# EAGLE design illumination_module (EAGLE 9.6.2)
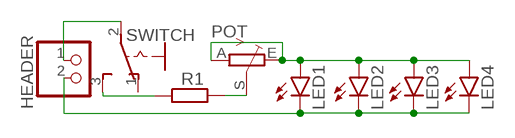
[diagram p0: schematic, sheet 1]

## Parts
HEADER  PINHD-1X2/90  [1X02/90]
LED1  LED5MM  [LED5MM]
LED2  LED5MM  [LED5MM]
LED3  LED5MM  [LED5MM]
LED4  LED5MM  [LED5MM]
POT  TRIM_EU-CA6H  [CA6H]
R1  R-EU_0207/10  [0207/10]
SWITCH  255SB  [255SB]

## Nets
N$1: LED1.A LED2.A LED3.A LED4.A POT.A POT.E
N$2: R1.1 SWITCH.3(S)
N$3: HEADER.2 LED1.K(C) LED2.K(C) LED3.K(C) LED4.K(C)
N$4: POT.S R1.2
N$5: HEADER.1 SWITCH.2(P)
Unconnected: SWITCH.1(O)

## Library data of the parts
HEADER = pinhead:PINHD-1X2: PIN HEADER
LED1-LED4 = led:LED: LED OSRAM: - CHIPLED LG R971, LG N971, LY N971, LG Q971, LY Q971, LO R971, LY R971 LH N974, LH R974 LS Q976, LO Q976, LY Q976 LO Q996 - Hyper CHIPLED LW Q18S LB Q993, LB Q99A, LB R99A - SideLED LS A670, LO A670, LY A670, LG A670, LP A670 LB A673, LV A673, LT A673, LW A673 LH A674 LY A675 LS A676, LA A676, LO A676, LY A676, LW A676 LS A679, LY A679, LG A679 - Hyper Micro SIDELED® LS Y876, LA Y876, LO Y876, LY Y876 LT Y87S - SmartLED LW L88C, LW L88S LB L89C, LB L89S, LG L890 LS L89K, LO L89K, LY L89K LS L896, LA L896, LO L896, LY L896 - TOPLED LS T670, LO T670, LY T670, LG T670, LP T670 LSG T670, LSP T670, LSY T670, LOP T670, LYG T670 LG T671, LOG T671, LSG T671 LB T673, LV T673, LT T673, LW T673 LH T674 LS T676, LA T676, LO T676, LY T676, LB T676, LH T676, LSB T676, LW T676 LB T67C, LV T67C, LT T67C, LS T67K, LO T67K, LY T67K, LW E67C LS E67B, LA E67B, LO E67B, LY E67B, LB E67C, LV E67C, LT E67C LW T67C LS T679, LY T679, LG T679 LS T770, LO T770, LY T770, LG T770, LP T770 LB T773, LV T773, LT T773, LW T773 LH T774 LS E675, LA E675, LY E675, LS T675 LS T776, LA T776, LO T776, LY T776, LB T776 LHGB T686 LT T68C, LB T68C - Hyper Mini TOPLED® LB M676 - Mini TOPLED Santana® LG M470 LS M47K, LO M47K, LY M47K Source: http://www.osram.convergy.de LUXEON: - LUMILED® LXK2-PW12-R00, LXK2-PW12-S00, LXK2-PW14-U00, LXK2-PW14-V00 LXK2-PM12-R00, LXK2-PM12-S00, LXK2-PM14-U00 LXK2-PE12-Q00, LXK2-PE12-R00, LXK2-PE12-S00, LXK2-PE14-T00, LXK2-PE14-U00 LXK2-PB12-K00, LXK2-PB12-L00, LXK2-PB12-M00, LXK2-PB14-N00, LXK2-PB14-P00, LXK2-PB14-Q00 LXK2-PR12-L00, LXK2-PR12-M00, LXK2-PR14-Q00, LXK2-PR14-R00 LXK2-PD12-Q00, LXK2-PD12-R00, LXK2-PD12-S00 LXK2-PH12-R00, LXK2-PH12-S00 LXK2-PL12-P00, LXK2-PL12-Q00, LXK2-PL12-R00 Source: www.luxeon.com KINGBRIGHT: KA-3528ASYC Source: www.kingbright.com
POT = pot:TRIM_EU-: POTENTIOMETER
R1 = rcl:R-EU_: RESISTOR, European symbol; SPICEPREFIX: R
SWITCH = switch:255SB: SLIDING SWITCH Distributor Buerklin, 11G810

## Board
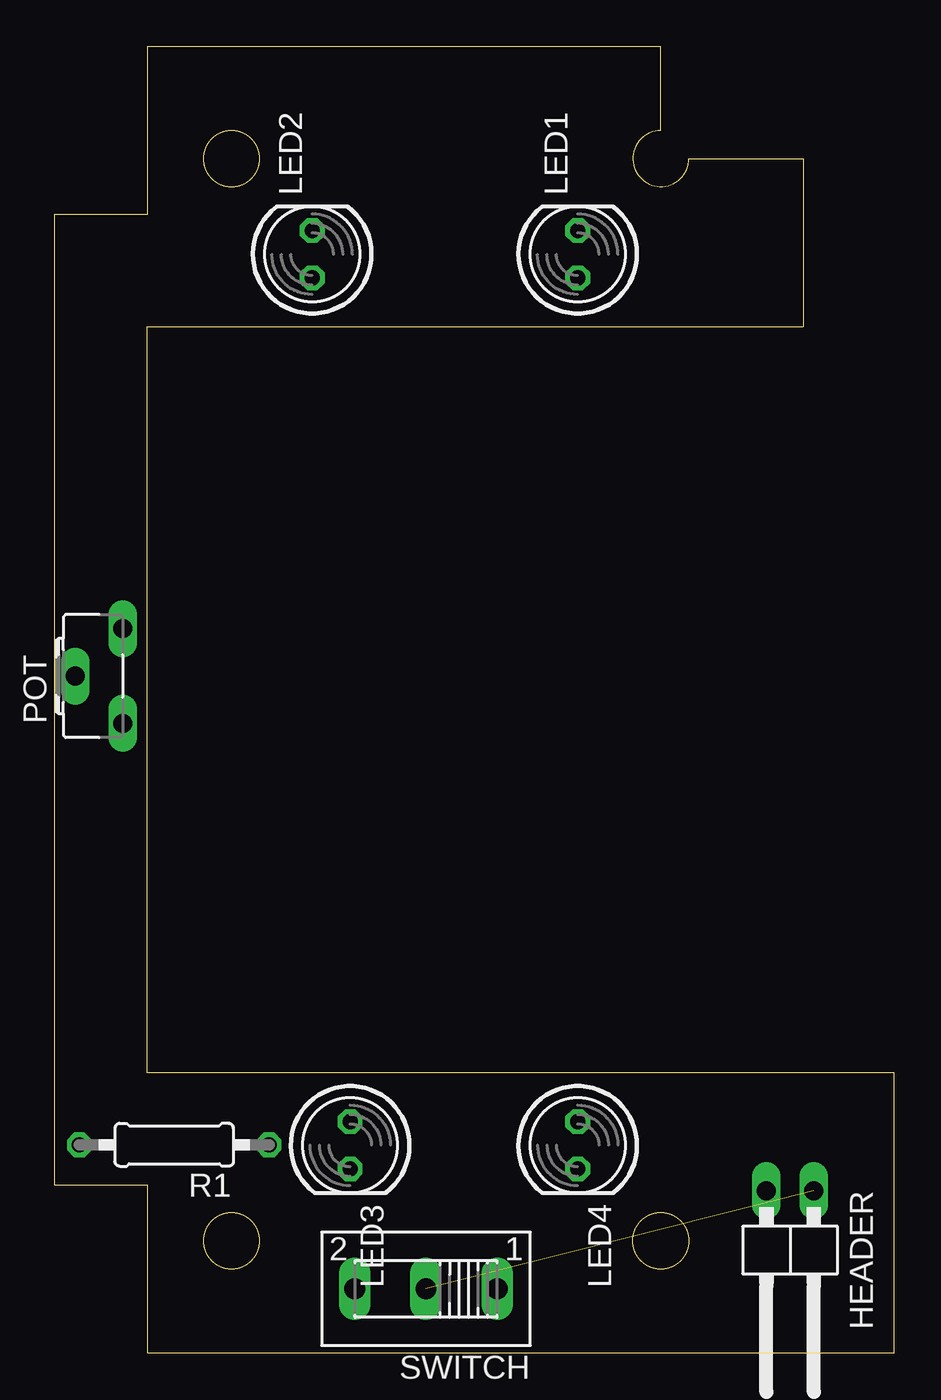
[diagram p1: board, top side]
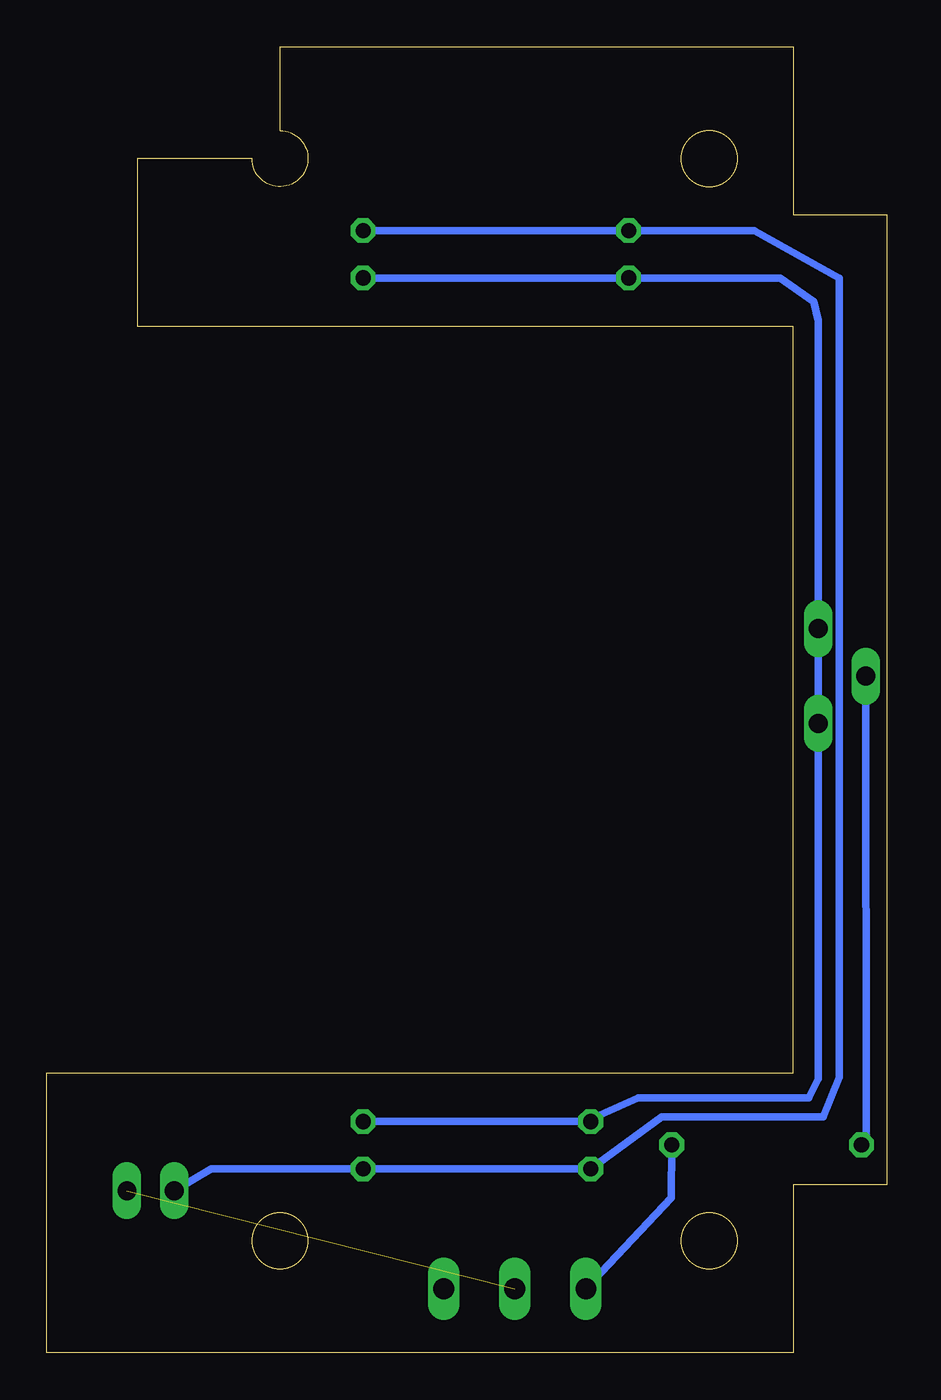
[diagram p2: board, bottom side, seen from below]

Size 45 x 70 mm. Coordinates in mm from the lower left corner, seen from the top.
Outline: 32.5,65.5 arc270 34,64 40.14,64 40.14,55 5,55 5,15 45,15 45,0 5,0 5,9 0,9 0,61 5,61 5,70 32.5,70 32.5,65.5
Outline: circle at 32.5,6 radius 1.5
Outline: circle at 9.5,64 radius 1.5
Outline: circle at 9.5,6 radius 1.5
Copper layers (1*16): Top 0.035mm / dielectric 1.5mm / Bottom 0.035mm
Design rules "default": minimum track width 6mil, minimum drill 0.35mm, track to track 6mil, track to pad 6mil, pad to pad 6mil, via to via 6mil, smd to smd 6mil, copper to edge 40mil, drill to drill 6mil, minimum pad ring 10mil, minimum via ring 8mil, stop-mask expansion 4mil, vias tented up to drill 0mil, thermal gap 10mil

### Footprints (pad centres in the part's own frame; a part is rotated, then mirrored left to right if it is on the bottom)
1X02/90 = drill 1.016 long: 1 -1.27,-3.81; 2 1.27,-3.81
LED5MM = drill 0.813 octagon: A -1.27,0; K 1.27,0
CA6H = drill 1.016 long: A -2.54,0; E 2.54,0; S 0,2.54
0207/10 = drill 0.813 octagon: 1 -5.08,0; 2 5.08,0
255SB = drill 1.118 long: 1 -3.81,0; 2 0,0; 3 3.81,0

### Placement (x,y rotation side)
HEADER  39.43,4.88 180 top
LED1  28.05,58.88 90 top
LED2  13.82,58.88 90 top
LED3  15.86,11.12 270 top
LED4  28.05,11.12 270 top
POT  3.66,36.27 90 top
R1  6.43,11.15 180 top
SWITCH  19.92,3.43 180 top

### Tracks (layer width: path | path; a pad name or v marks a point on that pad's centre or on a via)
N$1
  Bottom 0.406: LED4.A 16.11,12.39 | 16.11,12.39 LED3.A | LED1.A LED2.A 5.7,57.61 3.92,56.34 3.66,55.32 POT.E POT.A 3.66,14.68 4.17,13.66 13.32,13.66 16.11,12.39
N$2
  Bottom 0.406: SWITCH.3 11.53,8.32 R1.1
N$3
  Bottom 0.406: HEADER.2 36.18,9.85 LED4.K LED3.K 12.05,12.65 3.41,12.65 2.55,14.75 2.55,57.58 7.11,60.15 LED2.K LED1.K
N$4
  Bottom 0.406: POT.S 1.09,11.41
  Bottom 0.508: POT.S | 1.09,11.41 R1.2
N$5  (1 unrouted)